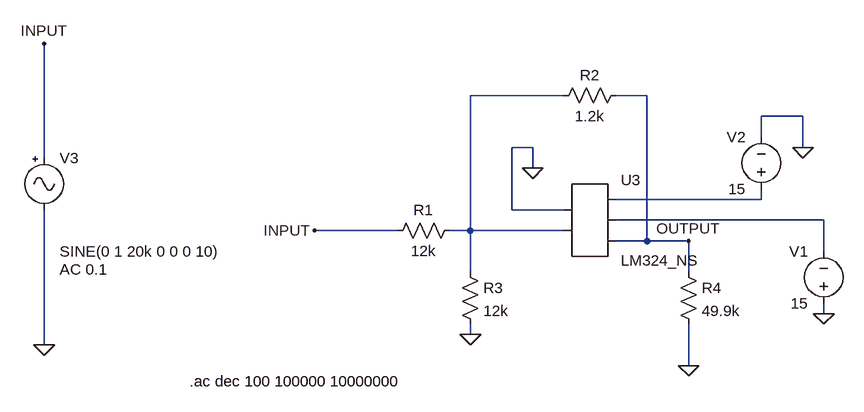
[diagram p0: schematic EJ_1_simulaciones_Inversor.asc]
EJ_1_simulaciones_Inversor.asc, the LTspice schematic file:
Version 4
SHEET 1 880 680
WIRE 160 -16 16 -16
WIRE 288 -16 240 -16
WIRE 528 16 464 16
WIRE 464 48 464 16
WIRE 112 64 80 64
WIRE 528 64 528 16
WIRE -640 80 -640 -96
WIRE 112 96 112 64
WIRE 464 144 464 128
WIRE 464 144 240 144
WIRE 80 160 80 64
WIRE 160 160 80 160
WIRE 560 176 240 176
WIRE -96 192 -224 192
WIRE 16 192 16 -16
WIRE 16 192 -16 192
WIRE 160 192 16 192
WIRE 288 208 288 -16
WIRE 288 208 240 208
WIRE 352 208 288 208
WIRE 560 224 560 176
WIRE 16 256 16 192
WIRE 352 256 352 208
WIRE 560 320 560 304
WIRE 16 352 16 336
WIRE -640 368 -640 160
WIRE 352 400 352 336
FLAG 112 96 0
FLAG -224 192 INPUT
FLAG 16 352 0
FLAG 352 400 0
FLAG 560 320 0
FLAG 528 64 0
FLAG 352 208 OUTPUT
FLAG -640 -96 INPUT
FLAG -640 368 0
SYMBOL res 0 176 R90
WINDOW 0 0 56 VBottom 2
WINDOW 3 32 56 VTop 2
SYMATTR InstName R1
SYMATTR Value 12k
SYMBOL res 144 0 R270
WINDOW 0 32 56 VTop 2
WINDOW 3 0 56 VBottom 2
SYMATTR InstName R2
SYMATTR Value 1.2k
SYMBOL res 0 240 R0
SYMATTR InstName R3
SYMATTR Value 12k
SYMBOL res 336 240 R0
SYMATTR InstName R4
SYMATTR Value 49.9k
SYMBOL voltage 464 144 R180
WINDOW 0 24 96 Left 2
WINDOW 3 24 16 Left 2
WINDOW 123 0 0 Left 2
WINDOW 39 0 0 Left 2
SYMATTR InstName V2
SYMATTR Value 15
SYMBOL voltage 560 320 R180
WINDOW 0 24 96 Left 2
WINDOW 3 24 16 Left 2
WINDOW 123 0 0 Left 2
WINDOW 39 0 0 Left 2
SYMATTR InstName V1
SYMATTR Value 15
SYMBOL Misc\\signal -640 64 R0
WINDOW 123 24 188 Left 2
WINDOW 39 0 0 Left 2
WINDOW 3 24 160 Left 2
SYMATTR Value2 AC 0.1
SYMATTR Value SINE(0 1 20k 0 0 0 10)
SYMATTR InstName V3
SYMBOL AutoGenerated\\LM324_NS 192 176 R0
SYMATTR InstName U3
TEXT -416 424 Left 2 !.ac dec 100 100000 10000000

The netlist it stands for:
* EJ_1_simulaciones_Inversor.asc
R1 N001 INPUT 12k
R2 N001 OUTPUT 1.2k
R3 N001 0 12k
R4 OUTPUT 0 49.9k
V2 N002 0 15
V1 0 N003 15
V3 INPUT 0 SINE(0 1 20k 0 0 0 10) AC 0.1
* U3: LM324_NS (symbol AutoGenerated\LM324_NS not available, pins judged from their places): pin1=0 pin2=N001 pin3=N002 pin4=N003 pin5=OUTPUT
.ac dec 100 100000 10000000
.backanno
.end